# Altium schematic sheet Top_level.SchDoc
size A4
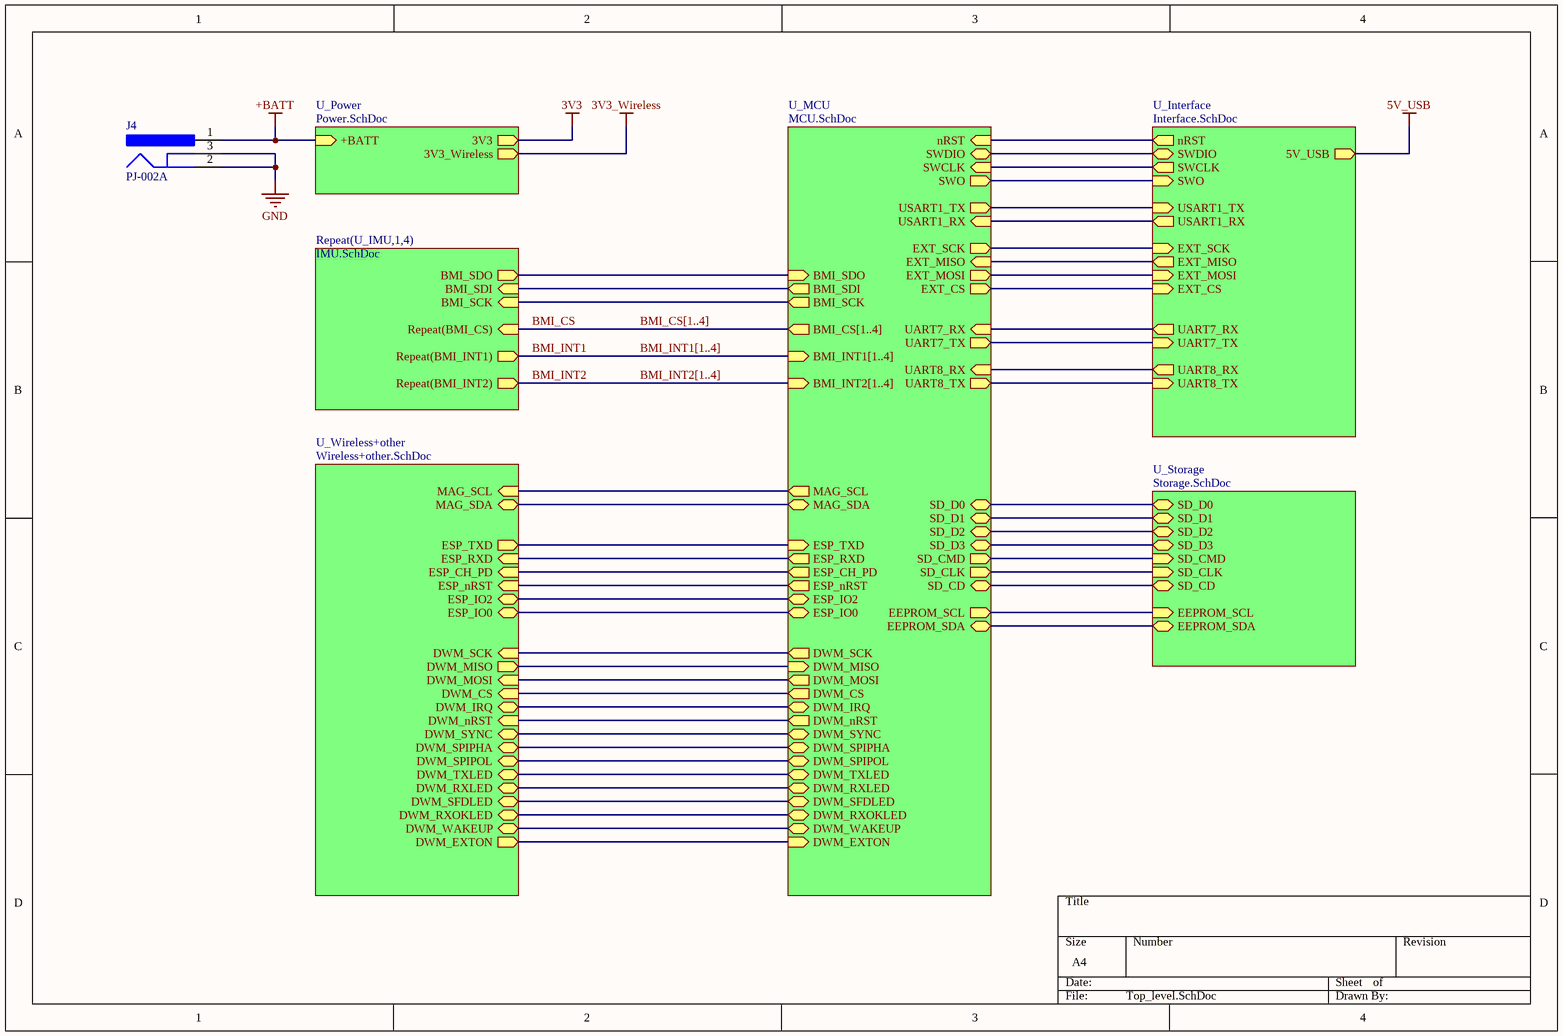
[diagram p0: Top_level.SchDoc]

## Parts
J4  PJ-002A  [CUI-PJ-002A_V]

## Sub-sheets
Repeat(U_IMU,1,4) = IMU.SchDoc: BMI_SDO (out), BMI_SDI (in), BMI_SCK (in), Repeat(BMI_CS) (in), Repeat(BMI_INT1) (out), Repeat(BMI_INT2) (out)
U_Interface = Interface.SchDoc: 5V_USB (out), EXT_SCK (in), EXT_MISO (out), EXT_MOSI (in), EXT_CS (in), SWO (in), nRST (out), UART8_RX (out), UART8_TX (in), SWDIO (bidir), SWCLK (out), UART7_RX (out), UART7_TX (in), USART1_TX (in), USART1_RX (out)
U_MCU = MCU.SchDoc: SWDIO (bidir), SD_D0 (bidir), SD_D1 (bidir), SD_D2 (bidir), SD_D3 (bidir), SD_CD (bidir), SD_CLK (out), SD_CMD (out), EEPROM_SCL (out), EEPROM_SDA (bidir), BMI_CS[1..4] (out), BMI_SDO (in), BMI_SDI (out), BMI_SCK (out), MAG_SCL (out), MAG_SDA (bidir), ESP_RXD (out), ESP_TXD (in), ESP_nRST (out), ESP_CH_PD (out), ESP_IO2 (bidir), ESP_IO0 (bidir), DWM_SCK (out), DWM_MISO (in), DWM_MOSI (out), DWM_CS (out), DWM_nRST (out), DWM_IRQ (bidir), DWM_SYNC (bidir), DWM_SPIPHA (bidir), DWM_SPIPOL (bidir), DWM_TXLED (bidir), DWM_RXLED (bidir), DWM_SFDLED (bidir), DWM_RXOKLED (bidir), DWM_WAKEUP (bidir), DWM_EXTON (in), BMI_INT1[1..4] (in), BMI_INT2[1..4] (in), EXT_SCK (out), EXT_MISO (in), EXT_MOSI (out), EXT_CS (out), SWCLK (in), SWO (out), nRST (in), UART8_TX (out), UART8_RX (in), UART7_RX (in), UART7_TX (out), USART1_TX (out), USART1_RX (in)
U_Power = Power.SchDoc: +BATT (in), 3V3 (out), 3V3_Wireless (out)
U_Storage = Storage.SchDoc: SD_D2 (bidir), SD_D3 (bidir), SD_D1 (bidir), SD_D0 (bidir), SD_CMD (in), SD_CLK (in), SD_CD (bidir), EEPROM_SCL (in), EEPROM_SDA (bidir)
U_Wireless+other = Wireless+other.SchDoc: MAG_SCL (in), MAG_SDA (bidir), ESP_TXD (out), ESP_nRST (in), ESP_CH_PD (in), ESP_IO2 (bidir), ESP_IO0 (bidir), ESP_RXD (in), DWM_SCK (in), DWM_MOSI (in), DWM_MISO (out), DWM_CS (in), DWM_nRST (in), DWM_IRQ (bidir), DWM_EXTON (out), DWM_WAKEUP (bidir), DWM_SYNC (bidir), DWM_SPIPHA (bidir), DWM_SPIPOL (bidir), DWM_TXLED (bidir), DWM_RXLED (bidir), DWM_SFDLED (bidir), DWM_RXOKLED (bidir)

## Nets
3V3: sheet U_Power/3V3
3V3_Wireless: sheet U_Power/3V3_Wireless
5V_USB: sheet U_Interface/5V_USB
+BATT: J4.1 ; sheet U_Power/+BATT
GND: J4.2 J4.3
BMI_CS: sheet Repeat(U_IMU,1,4)/Repeat(BMI_CS)
BMI_INT1: sheet Repeat(U_IMU,1,4)/Repeat(BMI_INT1)
BMI_INT2: sheet Repeat(U_IMU,1,4)/Repeat(BMI_INT2)
(unnamed): sheet U_MCU/SWDIO, sheet U_Interface/SWDIO
(unnamed): sheet U_MCU/SD_D0, sheet U_Storage/SD_D0
(unnamed): sheet U_MCU/SD_D1, sheet U_Storage/SD_D1
(unnamed): sheet U_MCU/SD_D2, sheet U_Storage/SD_D2
(unnamed): sheet U_MCU/SD_D3, sheet U_Storage/SD_D3
(unnamed): sheet U_MCU/SD_CD, sheet U_Storage/SD_CD
(unnamed): sheet U_MCU/SD_CLK, sheet U_Storage/SD_CLK
(unnamed): sheet U_MCU/SD_CMD, sheet U_Storage/SD_CMD
(unnamed): sheet U_MCU/EEPROM_SCL, sheet U_Storage/EEPROM_SCL
(unnamed): sheet U_MCU/EEPROM_SDA, sheet U_Storage/EEPROM_SDA
(unnamed): sheet U_MCU/BMI_SDO, sheet Repeat(U_IMU,1,4)/BMI_SDO
(unnamed): sheet U_MCU/BMI_SDI, sheet Repeat(U_IMU,1,4)/BMI_SDI
(unnamed): sheet U_MCU/BMI_SCK, sheet Repeat(U_IMU,1,4)/BMI_SCK
(unnamed): sheet U_MCU/MAG_SCL, sheet U_Wireless+other/MAG_SCL
(unnamed): sheet U_MCU/MAG_SDA, sheet U_Wireless+other/MAG_SDA
(unnamed): sheet U_MCU/ESP_RXD, sheet U_Wireless+other/ESP_RXD
(unnamed): sheet U_MCU/ESP_TXD, sheet U_Wireless+other/ESP_TXD
(unnamed): sheet U_MCU/ESP_nRST, sheet U_Wireless+other/ESP_nRST
(unnamed): sheet U_MCU/ESP_CH_PD, sheet U_Wireless+other/ESP_CH_PD
(unnamed): sheet U_MCU/ESP_IO2, sheet U_Wireless+other/ESP_IO2
(unnamed): sheet U_MCU/ESP_IO0, sheet U_Wireless+other/ESP_IO0
(unnamed): sheet U_MCU/DWM_SCK, sheet U_Wireless+other/DWM_SCK
(unnamed): sheet U_MCU/DWM_MISO, sheet U_Wireless+other/DWM_MISO
(unnamed): sheet U_MCU/DWM_MOSI, sheet U_Wireless+other/DWM_MOSI
(unnamed): sheet U_MCU/DWM_CS, sheet U_Wireless+other/DWM_CS
(unnamed): sheet U_MCU/DWM_nRST, sheet U_Wireless+other/DWM_nRST
(unnamed): sheet U_MCU/DWM_IRQ, sheet U_Wireless+other/DWM_IRQ
(unnamed): sheet U_MCU/DWM_SYNC, sheet U_Wireless+other/DWM_SYNC
(unnamed): sheet U_MCU/DWM_SPIPHA, sheet U_Wireless+other/DWM_SPIPHA
(unnamed): sheet U_MCU/DWM_SPIPOL, sheet U_Wireless+other/DWM_SPIPOL
(unnamed): sheet U_MCU/DWM_TXLED, sheet U_Wireless+other/DWM_TXLED
(unnamed): sheet U_MCU/DWM_RXLED, sheet U_Wireless+other/DWM_RXLED
(unnamed): sheet U_MCU/DWM_SFDLED, sheet U_Wireless+other/DWM_SFDLED
(unnamed): sheet U_MCU/DWM_RXOKLED, sheet U_Wireless+other/DWM_RXOKLED
(unnamed): sheet U_MCU/DWM_WAKEUP, sheet U_Wireless+other/DWM_WAKEUP
(unnamed): sheet U_MCU/DWM_EXTON, sheet U_Wireless+other/DWM_EXTON
(unnamed): sheet U_MCU/EXT_SCK, sheet U_Interface/EXT_SCK
(unnamed): sheet U_MCU/EXT_MISO, sheet U_Interface/EXT_MISO
(unnamed): sheet U_MCU/EXT_MOSI, sheet U_Interface/EXT_MOSI
(unnamed): sheet U_MCU/EXT_CS, sheet U_Interface/EXT_CS
(unnamed): sheet U_MCU/SWCLK, sheet U_Interface/SWCLK
(unnamed): sheet U_MCU/SWO, sheet U_Interface/SWO
(unnamed): sheet U_MCU/nRST, sheet U_Interface/nRST
(unnamed): sheet U_MCU/UART8_TX, sheet U_Interface/UART8_TX
(unnamed): sheet U_MCU/UART8_RX, sheet U_Interface/UART8_RX
(unnamed): sheet U_MCU/UART7_RX, sheet U_Interface/UART7_RX
(unnamed): sheet U_MCU/UART7_TX, sheet U_Interface/UART7_TX
(unnamed): sheet U_MCU/USART1_TX, sheet U_Interface/USART1_TX
(unnamed): sheet U_MCU/USART1_RX, sheet U_Interface/USART1_RX

## Buses and harness runs
bus BMI_CS[1..4] = sheet U_MCU/BMI_CS[1..4]
bus BMI_INT1[1..4] = sheet U_MCU/BMI_INT1[1..4]
bus BMI_INT2[1..4] = sheet U_MCU/BMI_INT2[1..4]

## Library data of the parts
J4 = CMP-2000-06895-2: Through Hole Right Angle DC Power Jack, 2.5 A, 2 mm Center Pin, 3 Position, -25 to 85 degC, RoHS, Bulk; Manufacturer: CUIInc.; Brand: CUI; Inside Contact Diameter: 2mm; Voltage Rating: 24V; Outside Contact Diameter: 6.5mm; Current Rating: 2.5A; Insulation Resistance: 50MOhms; Contact Gender: Male; Connector Type: DCPowerJack; Datasheet Version: Rev. 1.03, 04/2016; Housing Material: PolybutyleneTerephthalate(PBT); Operating Temperature Range: -25Cto+85C; Termination Style: ThroughHole; Product Category: DCPowerConnectors; Mounting Technology: ThroughHole; Mounting Style: ThroughHole; Factory Pack Quantity: 500; Contact Plating: Nickel; Package Reference: PJ-002A; Mounting Angle: Right; Package Description: 3-Pin Through Hole Device, Body 14.4 x 9 mm, Height 11 mm; Flammability Rating: UL94V-0; Manufacturer URL: http://www.cui.com/; Product: Jacks; Contact Material: Copper; Datasheet URL: http://www.cui.com/product/resource/pj-002a.pdf; RoHS: True